# EAGLE design HomeBoard (EAGLE 9.6.2)
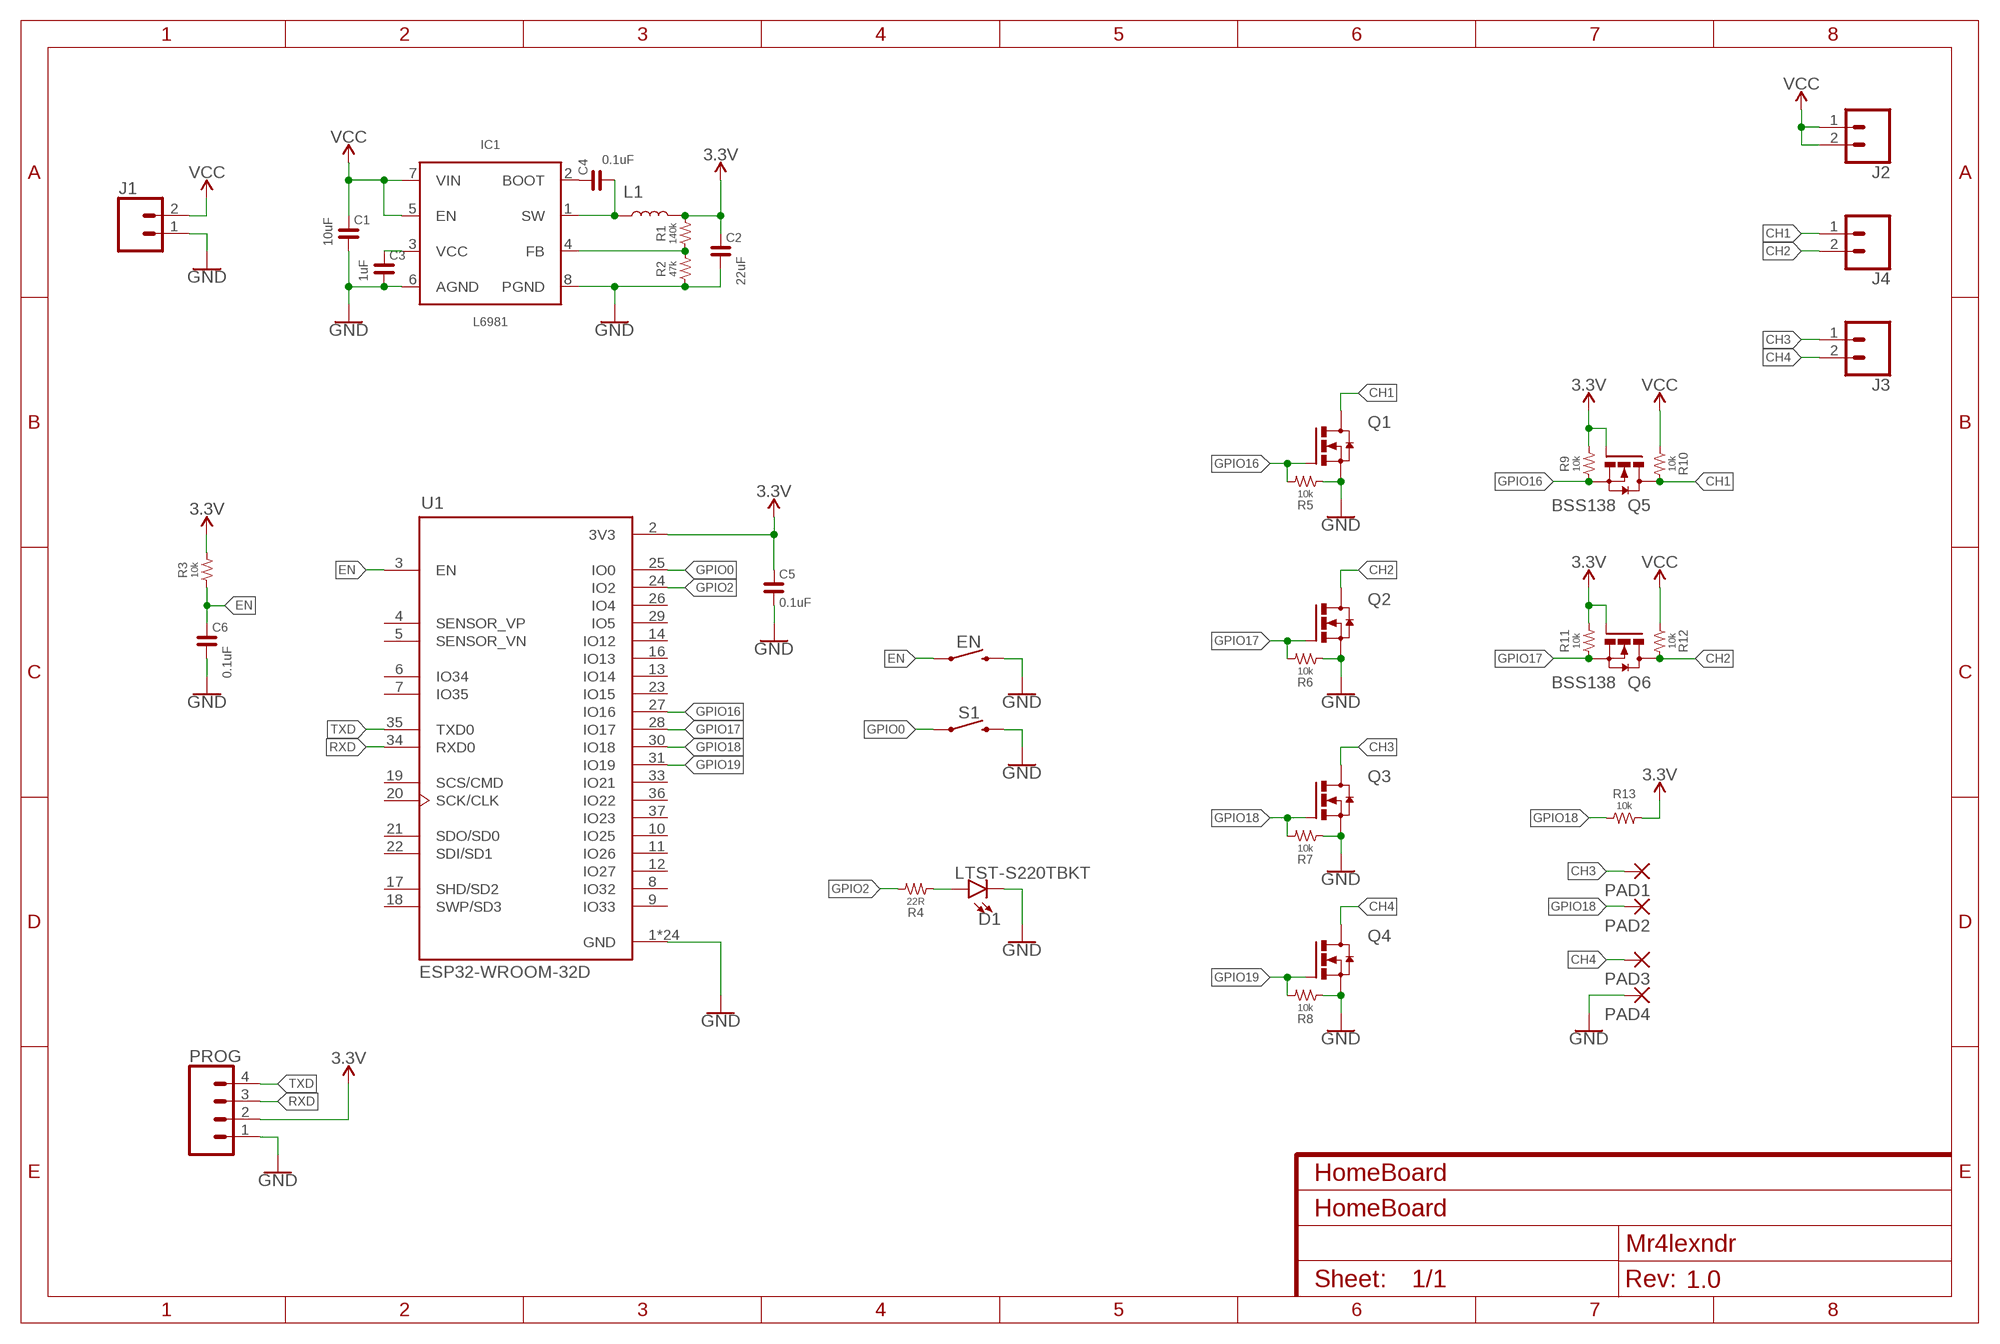
[diagram p0: schematic, sheet 1]
FRAME1 (FRAME-A4L): CNAME: HomeBoard; CREVISION: 1.0; DESIGNER: Mr4lexndr

## Parts
C1  10uF  CAP-1206  [1206]
C2  22uF  CAP-1206  [1206]
C3  1uF  CAP-0603  [0603]
C4  0.1uF  CAP-0603  [0603]
C5  0.1uF  CAP-0603  [0603]
C6  0.1uF  CAP-0603  [0603]
D1  LTST-S220TBKT  LED-ANGLE-2MM  [LED-ANGLE-2MM]
EN  MOMENTARY-SWITCH-SPST-SMD-6.0X3.5MM  [TACTILE_SWITCH_SMD_6.0X3.5MM]
IC1  L6981  [SO-8L]
J1  CONN_025MM  [SCREWTERMINAL-5MM-2]
J2  CONN_025MM  [SCREWTERMINAL-5MM-2]
J3  CONN_025MM  [SCREWTERMINAL-5MM-2]
J4  CONN_025MM  [SCREWTERMINAL-5MM-2]
L1  INDUCTOR-7.3X6.6  [INDUCTOR-7.3X6.6]
PAD1  SMD_PADSMD-1X1.5MM  [SMD1X1.5MM]
PAD2  SMD_PADSMD-1X1.5MM  [SMD1X1.5MM]
PAD3  SMD_PADSMD-1X1.5MM  [SMD1X1.5MM]
PAD4  SMD_PADSMD-1X1.5MM  [SMD1X1.5MM]
PROG  CONN_04LOCK  [1X04_LOCK]
Q1  MOSFET-N-DPAK  [D-PAK_TO252AA]
Q2  MOSFET-N-DPAK  [D-PAK_TO252AA]
Q3  MOSFET-N-DPAK  [D-PAK_TO252AA]
Q4  MOSFET-N-DPAK  [D-PAK_TO252AA]
Q5  BSS138  MOSFET-N-SOT23-3  [SOT23-3]
Q6  BSS138  MOSFET-N-SOT23-3  [SOT23-3]
R1  140k  RESISTOR0603  [0603]
R2  47k  RESISTOR0603  [0603]
R3  10k  RESISTOR0603  [0603]
R4  22R  RESISTOR0603  [0603]
R5  10k  RESISTOR0603  [0603]
R6  10k  RESISTOR0603  [0603]
R7  10k  RESISTOR0603  [0603]
R8  10k  RESISTOR0603  [0603]
R9  10k  RESISTOR0603  [0603]
R10  10k  RESISTOR0603  [0603]
R11  10k  RESISTOR0603  [0603]
R12  10k  RESISTOR0603  [0603]
R13  10k  RESISTOR0603  [0603]
S1  MOMENTARY-SWITCH-SPST-PTH-RIGHT-ANGLE-KIT  [TACTILE_SWITCH_PTH_RIGHT_ANGLE_KIT]
U1  ESP32-WROOM-32D  [MODULE_ESP32-WROOM-32D]

## Nets
3.3V: C2.2 C5.2 L1.P$2 PROG.2 Q5.1(G) Q6.1(G) R1.2 R3.2 R9.2 R11.2 R13.2 U1.2(3V3)
CH1: J4.1 Q1.4(D) Q5.3(D) R10.2
CH2: J4.2 Q2.4(D) Q6.3(D) R12.2
CH3: J3.1 PAD1.P$1(P) Q3.4(D)
CH4: J3.2 PAD3.P$1(P) Q4.4(D)
EN: C6.2 EN.1 R3.1 U1.3(EN)
GND: C1.1 C2.1 C3.1 C5.1 C6.1 D1.C EN.2 IC1.6(AGND) IC1.8(PGND) J1.1 PAD4.P$1(P) PROG.1 Q1.3(S) Q2.3(S) Q3.3(S) Q4.3(S) R2.1 R5.1 R6.1 R7.1 R8.1 S1.2 U1.1(GND) U1.15(GND) U1.38(GND) U1.39_1(GND) U1.39_2(GND) U1.39_3(GND) U1.39_4(GND) U1.39_5(GND) U1.39_6(GND) U1.39_7(GND) U1.39_8(GND) U1.39_9(GND) U1.39_10(GND) U1.39_11(GND) U1.39_12(GND) U1.39_13(GND) U1.39_14(GND) U1.39_15(GND) U1.39_16(GND) U1.39_17(GND) U1.39_18(GND) U1.39_19(GND) U1.39_20(GND) U1.39_21(GND)
GPIO0: S1.1 U1.25(IO0)
GPIO2: R4.2 U1.24(IO2)
GPIO16: Q1.1(G) Q5.2(S) R5.2 R9.1 U1.27(IO16)
GPIO17: Q2.1(G) Q6.2(S) R6.2 R11.1 U1.28(IO17)
GPIO18: PAD2.P$1(P) Q3.1(G) R7.2 R13.1 U1.30(IO18)
GPIO19: Q4.1(G) R8.2 U1.31(IO19)
N$1: IC1.4(FB) R1.1 R2.2
N$2: C4.1 IC1.1(SW) L1.P$1
N$3: C4.2 IC1.2(BOOT)
N$4: D1.A R4.1
N$7: C3.2 IC1.3(VCC)
RXD: PROG.3 U1.34(RXD0)
TXD: PROG.4 U1.35(TXD0)
VCC: C1.2 IC1.5(EN) IC1.7(VIN) J1.2 J2.1 J2.2 R10.1 R12.1
Unconnected: U1.4(SENSOR_VP) U1.5(SENSOR_VN) U1.6(IO34) U1.7(IO35) U1.8(IO32) U1.9(IO33) U1.10(IO25) U1.11(IO26) U1.12(IO27) U1.13(IO14) U1.14(IO12) U1.16(IO13) U1.17(SHD/SD2) U1.18(SWP/SD3) U1.19(SCS/CMD) U1.20(SCK/CLK) U1.21(SDO/SD0) U1.22(SDI/SD1) U1.23(IO15) U1.26(IO4) U1.29(IO5) U1.33(IO21) U1.36(IO22) U1.37(IO23)

## Library data of the parts
C1-C6 = #AK-Library:CAP
D1 = #AK-Library:LED: LED (Generic) Standard schematic elements and footprints for 5mm, 3mm, 1206, and 0603 sized LEDs. Generic LEDs with no color specified.
EN = #AK-Library:MOMENTARY-SWITCH-SPST: Momentary Switch (Pushbutton) - SPST Normally-open (NO) SPST momentary switches (buttons, pushbuttons). Variants PTH-12MM - 12mm square, through-hole Momentary Pushbutton Switch - 12mm Square <https://www.sparkfun.com/products/9190> (COM-09190) PTH-6.0MM, PTH-6.0MM-KIT - 6.0mm square, through-hole Mini Pushbutton Switch <https://www.sparkfun.com/products/97> (COM-00097) KIT package intended for soldering kit's - only one side of pads' copper is exposed. PTH-RIGHT-ANGLE-KIT - Right-angle, through-hole Right Angle Tactile Button <https://www.sparkfun.com/products/10791> - Used on SparkFun BigTime Watch Kit <https://www.sparkfun.com/products/11734> SMD-12MM - 12mm square, surface-mount Tactile Button - SMD (12mm) <https://www.sparkfun.com/products/12993> (COM-12993) Used on SparkFun PicoBoard <https://www.sparkfun.com/products/11888> SMD-4.5MM - 4.5mm Square Trackball Switch Used on SparkFun Blackberry Trackballer Breakout <https://www.sparkfun.com/products/13169> SMD-4.6MMX2.8MM - 4.60mm x 2.80mm, surface mount Used on SparkFun SAMD21 Mini Breakout <https://www.sparkfun.com/products/13664> SMD-5.2MM, SMD-5.2-REDUNDANT - 5.2mm square, surface-mount Mini Pushbutton Switch - SMD <https://www.sparkfun.com/products/8720> (COM-08720) Used on Arduino Pro Mini <https://www.sparkfun.com/products/11114> REDUNDANT package connects both switch circuits together SMD-6.0X3.5MM - 6.0 x 3.5mm, surface mount Momentary Reset Switch SMD <https://www.sparkfun.com/products/8229> (COM-08229) SMD-6.2MM-TALL - 6.2mm square, surface mount Tactile Button - SMD (6mm) <https://www.sparkfun.com/products/12992> Used on SparkFun Digital Sandbox <https://www.sparkfun.com/products/12651> SMD-RIGHT-ANGLE - Right-angle, surface mount Used on SparkFun Block for Intel® Edison - Arduino <https://www.sparkfun.com/products/13036>; PROD_ID: SWCH-00815; SF_SKU: COM-08229
IC1 = #AK-Library:L6981: L6981 38 V, 1.5 A synchronous step-down converter
J1-J4 = #Connectors:CONN_02: Multi connection point. Often used as Generic Header-pin footprint for 0.1 inch spaced/style header connections On any of the 0.1 inch spaced packages, you can populate with these: Break Away Headers - Straight <https://www.sparkfun.com/products/116> (PRT-00116) Break Away Male Headers - Right Angle <https://www.sparkfun.com/products/553> (PRT-00553) Female Headers <https://www.sparkfun.com/products/115> (PRT-00115) Break Away Headers - Machine Pin <https://www.sparkfun.com/products/117> (PRT-00117) Break Away Female Headers - Swiss Machine Pin <https://www.sparkfun.com/products/743> (PRT-00743) For SCREWTERMINALS and SPRING TERMINALS visit here: Screw Terimnals on SparkFun.com <https://www.sparkfun.com/search/results?term=Screw+Terminals> (5mm/3.5mm/2.54mm spacing) This device is also useful as a general connection point to wire up your design to another part of your project. Our various solder wires solder well into these plated through hole pads. Hook-Up Wire - Assortment (Stranded, 22 AWG) <https://www.sparkfun.com/products/11375> (PRT-11375) Hook-Up Wire - Assortment (Solid Core, 22 AWG) <https://www.sparkfun.com/products/11367> (PRT-11367) View the entire wire category on our website here <https://www.sparkfun.com/categories/141> Special notes: Molex polarized connector foot print use with: PRT-08233 with associated crimp pins and housings. 2.54_SCREWTERM for use with PRT-10571. 3.5mm Screw Terminal footprints for PRT-08084 5mm Screw Terminal footprints for use with PRT-08432; SF_SKU: PRT-08432
L1 = #AK-Library:INDUCTOR: Inductor Resist changes in electrical current. Basically a coil of wire.
PAD1-PAD4 = #Connectors:SMD_PAD
PROG = #Connectors:CONN_04: Multi connection point. Often used as Generic Header-pin footprint for 0.1 inch spaced/style header connections On any of the 0.1 inch spaced packages, you can populate with these: Break Away Headers - Straight <https://www.sparkfun.com/products/116> (PRT-00116) Break Away Male Headers - Right Angle <https://www.sparkfun.com/products/553> (PRT-00553) Female Headers <https://www.sparkfun.com/products/115> (PRT-00115) Break Away Headers - Machine Pin <https://www.sparkfun.com/products/117> (PRT-00117) Break Away Female Headers - Swiss Machine Pin <https://www.sparkfun.com/products/743> (PRT-00743) For SCREWTERMINALS and SPRING TERMINALS visit here: Screw Terimnals on SparkFun.com <https://www.sparkfun.com/search/results?term=Screw+Terminals> (5mm/3.5mm/2.54mm spacing) This device is also useful as a general connection point to wire up your design to another part of your project. Our various solder wires solder well into these plated through hole pads. Hook-Up Wire - Assortment (Stranded, 22 AWG) <https://www.sparkfun.com/products/11375> (PRT-11375) Hook-Up Wire - Assortment (Solid Core, 22 AWG) <https://www.sparkfun.com/products/11367> (PRT-11367) View the entire wire category on our website here <https://www.sparkfun.com/categories/141> Special notes: Molex polarized connector foot print use with SKU : PRT-08231 with associated crimp pins and housings. 1MM SMD Version SKU: PRT-10208; PROD_ID: CONN-09696
Q1-Q6 = #AK-Library:MOSFET-N: N-Channel MOSFET in various packages Packages: SOT23-3: BSS138, TO-252 (D-PAK): RFD14N05L
R1-R13 = #AK-Library:RESISTOR: Generic Resistor Package
S1 = #AK-Library:MOMENTARY-SWITCH-SPST: Momentary Switch (Pushbutton) - SPST Normally-open (NO) SPST momentary switches (buttons, pushbuttons). Variants PTH-12MM - 12mm square, through-hole Momentary Pushbutton Switch - 12mm Square <https://www.sparkfun.com/products/9190> (COM-09190) PTH-6.0MM, PTH-6.0MM-KIT - 6.0mm square, through-hole Mini Pushbutton Switch <https://www.sparkfun.com/products/97> (COM-00097) KIT package intended for soldering kit's - only one side of pads' copper is exposed. PTH-RIGHT-ANGLE-KIT - Right-angle, through-hole Right Angle Tactile Button <https://www.sparkfun.com/products/10791> - Used on SparkFun BigTime Watch Kit <https://www.sparkfun.com/products/11734> SMD-12MM - 12mm square, surface-mount Tactile Button - SMD (12mm) <https://www.sparkfun.com/products/12993> (COM-12993) Used on SparkFun PicoBoard <https://www.sparkfun.com/products/11888> SMD-4.5MM - 4.5mm Square Trackball Switch Used on SparkFun Blackberry Trackballer Breakout <https://www.sparkfun.com/products/13169> SMD-4.6MMX2.8MM - 4.60mm x 2.80mm, surface mount Used on SparkFun SAMD21 Mini Breakout <https://www.sparkfun.com/products/13664> SMD-5.2MM, SMD-5.2-REDUNDANT - 5.2mm square, surface-mount Mini Pushbutton Switch - SMD <https://www.sparkfun.com/products/8720> (COM-08720) Used on Arduino Pro Mini <https://www.sparkfun.com/products/11114> REDUNDANT package connects both switch circuits together SMD-6.0X3.5MM - 6.0 x 3.5mm, surface mount Momentary Reset Switch SMD <https://www.sparkfun.com/products/8229> (COM-08229) SMD-6.2MM-TALL - 6.2mm square, surface mount Tactile Button - SMD (6mm) <https://www.sparkfun.com/products/12992> Used on SparkFun Digital Sandbox <https://www.sparkfun.com/products/12651> SMD-RIGHT-ANGLE - Right-angle, surface mount Used on SparkFun Block for Intel® Edison - Arduino <https://www.sparkfun.com/products/13036>; PROD_ID: CONN-10672; SF_SKU: COM-10791
U1 = #AK-Library:ESP32-WROOM-32D: Bluetooth, WiFi 802.11b/g/n, Bluetooth v4.2 + EDR, Class 1, 2 and 3 Transceiver Module 2.4GHz ~ 2.5GHz Integrated, Trace Surface Mount Check prices <https://pricing.snapeda.com/parts/ESP32-WROOM-32D/Espressif%20Systems/view-part?ref=eda>; AVAILABILITY: Not in stock; DESCRIPTION: Bluetooth, WiFi 802.11b/g/n, Bluetooth v4.2 +EDR, Class 1, 2 and 3 Transceiver Module 2.4GHz ~ 2.5GHz Integrated; MF: Espressif Systems; MP: ESP32-WROOM-32D; PACKAGE: Module Espressif Systems; PRICE: None

## Board
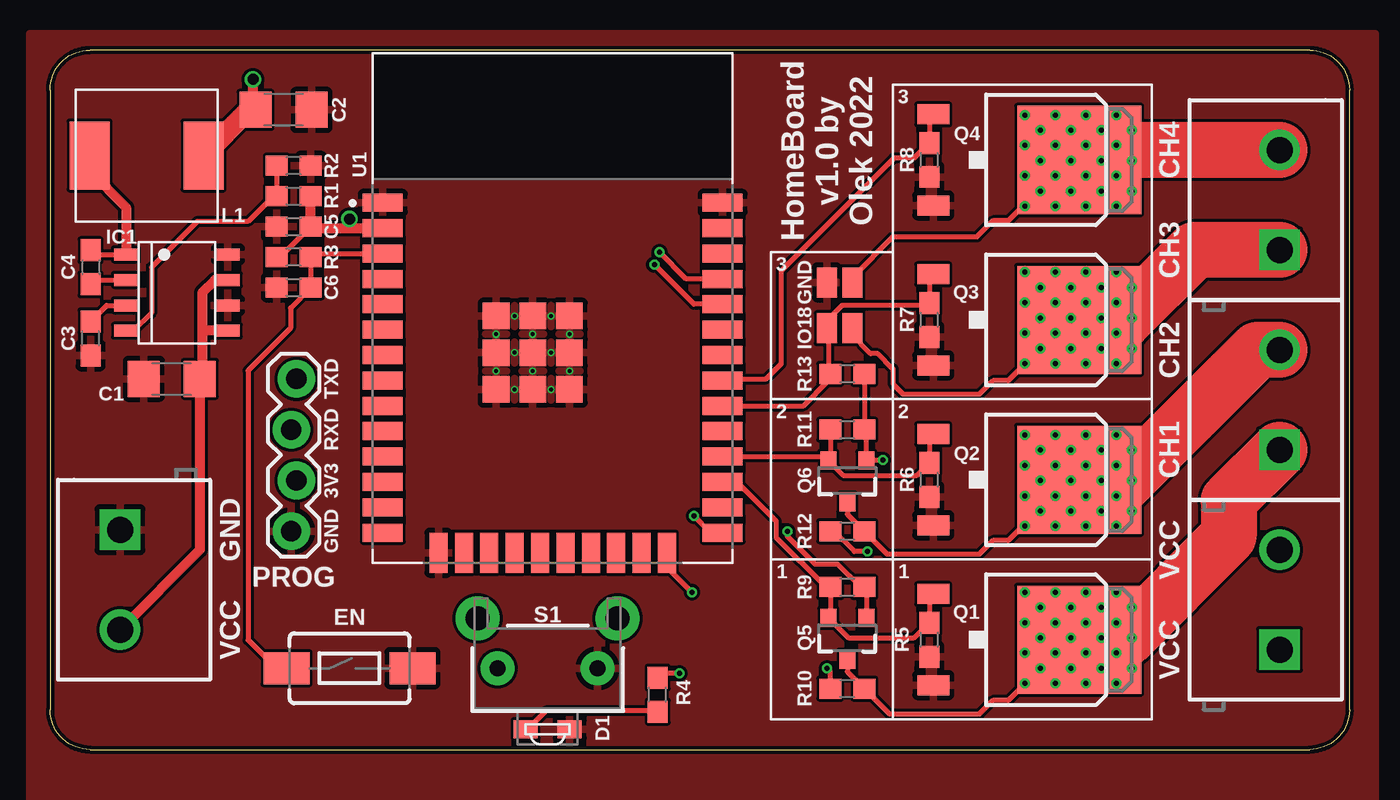
[diagram p1: board, top side]
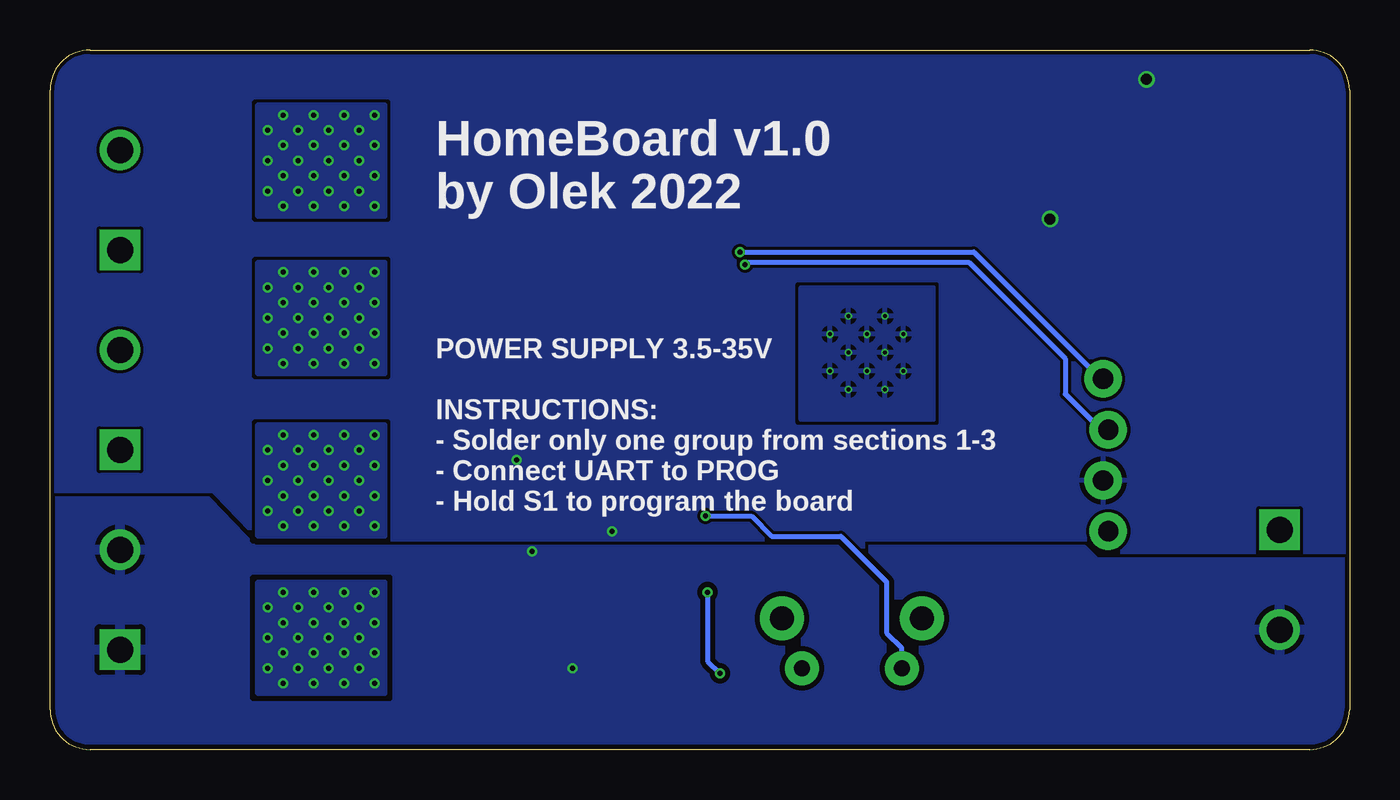
[diagram p2: board, bottom side, seen from below]

Size 65 x 35 mm. Coordinates in mm from the lower left corner, seen from the top.
Outline: 2,0 63,0 arc90 65,2 65,33 arc90 63,35 2,35 arc90 0,33 0,2 arc90 2,0
Copper layers (1*16): Top 0.035mm / dielectric 1.5mm / Bottom 0.035mm
Design rules "JLCPCB": minimum track width 6mil, minimum drill 0.2mm, track to track 6mil, track to pad 6mil, pad to pad 6mil, via to via 6mil, smd to smd 6mil, copper to edge 0.2mm, drill to drill 0.1mm, minimum pad ring 3mil, minimum via ring 0.125mm, stop-mask expansion 4mil, vias tented up to drill 0.75mm, thermal gap 10mil

### Footprints (pad centres in the part's own frame; a part is rotated, then mirrored left to right if it is on the bottom)
1206 = smd 1.6 x 1.8: 1 -1.4,0; 2 1.4,0
0603 = smd 1.1 x 1: 1 -0.85,0; 2 0.85,0
LED-ANGLE-2MM = smd 0.9 x 1.2: A 0,1.1; C 0,-1.1
TACTILE_SWITCH_SMD_6.0X3.5MM = smd 2.3 x 1.6: 1 -3.15,0; 2 3.15,0
SO-8L = smd 0.6 x 1.2: 1 -1.905,-2.54; 2 -0.635,-2.54; 3 0.635,-2.54; 4 1.905,-2.54; 5 1.905,2.54; 6 0.635,2.54; 7 -0.635,2.54; 8 -1.905,2.54
SCREWTERMINAL-5MM-2 = drill 1.3 pad 2.032 square: 1 0,0 | drill 1.3 pad 2.032: 2 5,0
INDUCTOR-7.3X6.6 = smd 2 x 3.4: P$1 -2.85,0; P$2 2.85,0
SMD1X1.5MM = smd 1.5 x 1: P$1 0,0
1X04_LOCK = drill 1.016 pad 1.88: 1 0,0.127; 2 2.54,-0.127; 3 5.08,0.127; 4 7.62,-0.127
D-PAK_TO252AA = smd 1 x 1.6: 1 -2.28,-4.8; 3 2.28,-4.8 | smd 5.4 x 6.2: 4 0,2.5
SOT23-3 = smd 0.8 x 0.9: 1 -0.95,-1; 2 0.95,-1; 3 0,1.1
TACTILE_SWITCH_PTH_RIGHT_ANGLE_KIT = drill 0.8 pad 1.7: 1 -2.5,0; 2 2.5,0 | drill 1.2 pad 2.2: ANCHOR1 -3.5,2.5; ANCHOR2 3.5,2.5
MODULE_ESP32-WROOM-32D = smd 2 x 0.9: 1 -8.5,5.26; 2 -8.5,3.99; 3 -8.5,2.72; 4 -8.5,1.45; 5 -8.5,0.18; 6 -8.5,-1.09; 7 -8.5,-2.36; 8 -8.5,-3.63; 9 -8.5,-4.9; 10 -8.5,-6.17; 11 -8.5,-7.44; 12 -8.5,-8.71; 13 -8.5,-9.98; 14 -8.5,-11.25; 25 8.5,-11.25; 26 8.5,-9.98; 27 8.5,-8.71; 28 8.5,-7.44; 29 8.5,-6.17; 30 8.5,-4.9; 31 8.5,-3.63; 32 8.5,-2.36; 33 8.5,-1.09; 34 8.5,0.18; 35 8.5,1.45; 36 8.5,2.72; 37 8.5,3.99; 38 8.5,5.26 | smd 0.9 x 2: 15 -5.715,-12.25; 16 -4.445,-12.25; 17 -3.175,-12.25; 18 -1.905,-12.25; 19 -0.635,-12.25; 20 0.635,-12.25; 21 1.905,-12.25; 22 3.175,-12.25; 23 4.445,-12.25; 24 5.715,-12.25 | smd 1.33 x 1.33: 39_1 -2.835,-0.405; 39_2 -1,-0.405; 39_3 0.835,-0.405; 39_4 -2.835,-2.24; 39_5 -1,-2.24; 39_6 0.835,-2.24; 39_7 -2.835,-4.075; 39_8 -1,-4.075; 39_9 0.835,-4.075 | drill 0.2 pad 0.3: 39_10 -1.917,-0.405; 39_11 -0.083,-0.405; 39_12 -2.835,-1.323; 39_13 -1,-1.323; 39_14 0.835,-1.323; 39_15 -1.917,-2.24; 39_16 -0.083,-2.24; 39_17 -2.835,-3.158; 39_18 -1,-3.158; 39_19 0.835,-3.158; 39_20 -1.917,-4.075; 39_21 -0.083,-4.075

### Placement (x,y rotation side)
C1  6.1,18.54 0 top
C2  11.68,32 180 top
C3  2.03,20.57 90 top
C4  2.03,24.13 270 top
C5  12.19,26.16 0 top
C6  12.19,23.11 0 top
D1  24.89,1.02 90 top
EN  14.99,4.06 0 top
IC1  6.35,22.86 270 top
J1  3.5,11 270 top
J2  61.5,5 90 top
J3  61.5,25 90 top
J4  61.5,15 90 top
L1  4.83,29.72 0 top
PAD1  40.13,21.08 270 top
PAD2  38.86,21.08 270 top
PAD3  40.13,23.37 270 top
PAD4  38.86,23.37 270 top
PROG  12.19,10.92 90 top
Q1  48.98,5.5 270 top
Q2  48.98,13.5 270 top
Q3  48.98,21.5 270 top
Q4  48.98,29.5 270 top
Q5  39.88,5.59 180 top
Q6  39.88,13.46 180 top
R1  12.19,27.69 0 top
R2  12.19,29.21 180 top
R3  12.19,24.64 180 top
R4  30.39,2.75 90 top
R5  43.98,5.5 90 top
R6  43.98,13.5 90 top
R7  43.98,21.5 90 top
R8  43.98,29.5 90 top
R9  39.88,8.13 0 top
R10  39.88,3.05 0 top
R11  39.88,16 0 top
R12  39.88,10.92 0 top
R13  39.88,18.8 0 top
S1  24.89,4.06 0 top
U1  25.15,22.1 0 top

### Tracks (layer width: path | path; a pad name or v marks a point on that pad's centre or on a via)
3.3V  (via drill 0.25, 0.55)
  Top 0.254: C5.2 11.52,24.64 R3.2 | 40.83,15.9 Q6.1 40.84,14.48 v41.66,14.48 | 40.83,15.9 R11.2 | R9.2 40.83,8.03 Q5.1 40.84,6.6 | R9.2 40.73,8.22 | v36.88,10.92 36.88,10.67 38.28,9.27 39.4,9.27 40.54,8.13 R9.2 | R13.2 R11.2 | R11.2 40.83,15.9
  Top 0.508: R1.2 C5.2 13.12,26.09 14.73,26.09 14.99,26.09 | 10.28,31.88 C2.2 10.16,32.13 v10.16,33.53 | 14.99,26.09 U1.2 | 14.99,26.09 v14.99,26.54
  Top 1.016: L1.P$2 9.96,32 C2.2
  pour Bottom (rank 3): -0.25,35.31 -0.25,-1.52 65.53,-1.52 65.53,35.56 -0.25,35.56
CH1  (via drill 0.25)
  Top 0.254: Q5.3 39.88,3.9 R10.2 42,1.78 46.49,1.78 47.17,2.45 47.93,2.45 50.98,5.5 51.31,5.5 Q1.4
  Top 2.794: 53.09,5.08 v51.82,6.35 | 51.31,5.5 Q1.4 | 51.31,5.5 51.14,5.5 v51.05,5.59 | J4.1 58.96,12.46 58.96,10.68 53.78,5.5 51.31,5.5
  other vias: 48.77,7.87 49.53,7.11 50.29,7.87 50.29,6.35 48.77,6.35 49.53,5.59 48.77,4.83 49.53,4.06 48.77,3.3 50.29,3.3 50.29,4.83 51.05,4.06 51.82,3.3 51.82,4.83 51.05,7.11 51.82,7.87 52.58,7.11 52.58,5.59 52.58,4.06 53.34,3.3 54.1,4.06 53.34,4.83 53.34,6.35 53.34,7.87 54.1,7.11 54.1,5.59
  pour Bottom: 48.26,8.38 48.26,2.79 54.61,2.79 54.61,8.38
CH2  (via drill 0.25)
  Top 0.254: Q6.3 39.88,11.77 R12.2 41.87,9.78 46.49,9.78 47.17,10.45 47.93,10.45 50.49,13.01 50.98,13.5 51.05,13.5
  Top 2.794: Q2.4 52.44,13.5 | Q2.4 51.05,13.5 | Q2.4 51.45,13.46 v51.05,13.46 | J4.2 60.39,20 52.81,12.43 51.07,12.43 50.49,13.01
  other vias: 48.77,15.75 49.53,13.46 50.29,15.75 49.53,14.99 48.77,14.22 50.29,14.22 48.77,12.7 48.77,11.18 49.53,11.94 50.29,11.18 50.29,12.7 51.05,14.99 51.82,15.75 51.82,12.7 51.05,11.94 51.82,11.18 52.58,11.94 52.58,13.46 52.58,14.99 53.34,15.75 53.34,14.22 53.34,12.7 53.34,11.18 54.1,11.94 54.1,13.46 54.1,14.99 51.82,14.22
  pour Bottom: 48.26,16.26 48.26,10.67 54.61,10.67 54.61,16.26
CH3  (via drill 0.25)
  Top 0.254: PAD1.P$1 40.13,20.73 41.05,19.81 41.4,19.81 42.16,19.05 42.16,18.29 42.67,17.78 46.49,17.78 47.17,18.45 47.93,18.45 50.98,21.5 Q3.4
  Top 2.794: Q3.4 51.82,21.17 v51.82,20.83 | J3.1 57.26,25 53.59,21.34 52.83,21.34 v51.82,22.35
  Top 3.048: Q3.4 53,21.5
  other vias: 48.77,23.88 49.53,23.11 50.29,22.35 51.05,21.59 52.58,20.07 53.34,19.3 48.77,22.35 48.77,20.83 49.53,21.59 50.29,23.88 51.05,23.11 51.82,23.88 52.58,23.11 52.58,21.59 53.34,20.83 53.34,22.35 53.34,23.88 49.53,20.07 54.1,23.11 54.1,21.59 54.1,20.07 51.82,19.3 50.29,19.3 50.29,20.83 51.05,20.07 48.77,19.3
  pour Bottom: 48.26,24.38 48.26,18.8 54.61,18.8 54.61,24.38
CH4  (via drill 0.25)
  Top 0.254: 51.05,29.5 50.98,29.5 47.93,26.45 47.17,26.45 46.37,25.65 42.16,25.65 40.13,23.62 PAD3.P$1
  Top 2.794: Q4.4 51.05,29.5 | Q4.4 51.48,29.03 v51.82,28.7 | 51.98,30 Q4.4 | J3.2 51.95,30 51.75,30.2
  Top 3.048: 51.75,30.2 51.05,29.5
  other vias: 48.77,31.75 49.53,30.99 50.29,31.75 50.29,30.23 48.77,30.23 49.53,29.46 48.77,28.7 48.77,27.18 49.53,27.94 50.29,28.7 50.29,27.18 51.05,27.94 51.05,29.46 51.05,30.99 51.82,31.75 51.82,30.23 51.82,27.18 52.58,27.94 52.58,29.46 52.58,30.99 53.34,31.75 53.34,30.23 53.34,28.7 53.34,27.18 54.1,27.94 54.1,29.46 54.1,30.99
  pour Bottom (rank 2): 48.26,32.26 48.26,26.67 54.61,26.67 54.61,32.26
EN
  Top 0.254: U1.3 13.22,24.82 R3.1 C6.2 12.03,22.1 12.03,21.08 9.91,18.96 9.91,5.49 11.33,4.06 EN.1
GND
  pour Bottom (rank 2): 20.83,23.11 20.83,16.51 27.43,16.51 27.43,23.11
  pour Top: -1.02,35.81 66.29,35.81 66.29,-2.54 -1.02,-2.54
GPIO0  (via drill 0.25)
  Top 0.254: U1.25 33.04,10.85 32.61,11.28 v32.21,11.68
  Bottom 0.254: S1.1 22.39,5.08 23.15,5.84 23.15,8.38 25.44,10.67 28.91,10.67 29.92,11.68 v32.21,11.68
GPIO2  (via drill 0.25)
  Top 0.254: 30.9,9.81 U1.24 30.86,9.12 v32.11,7.87 | R4.2 30.61,3.81 v31.5,3.81
  Bottom 0.254: v32.11,7.87 32.11,4.42 v31.5,3.81
GPIO16
  Top 0.254: Q1.1 44.11,7.71 43.98,7.58 R5.2 43.22,5.59 39.93,5.59 Q5.2 39.03,6.69 R9.1 | U1.27 34.04,13.39 | 34.04,13.39 34.36,13.39 | 39.03,8.22 R9.1 | 34.36,13.39 36.32,11.43 36.32,10.62 38.81,8.13 R9.1 | 34.36,13.39 34.04,13.39
GPIO17
  Top 0.254: Q2.1 43.98,15.58 R6.2 43.35,13.72 39.67,13.72 Q6.2 38.89,14.5 | U1.28 38.73,14.66 38.89,14.5 | R11.1 39.03,14.64 38.89,14.5
GPIO18
  Top 0.254: Q3.1 43.98,23.58 R7.2 43.86,22.23 39.62,22.23 38.86,21.46 PAD2.P$1 38.95,21 38.95,18.71 | 38.95,18.71 R13.1 | U1.30 37.68,17.2 38.95,18.46 38.95,18.71
GPIO19
  Top 0.254: Q4.1 43.98,31.58 R8.2 43.22,29.59 42.21,29.59 36.58,23.96 36.58,19.3 35.81,18.54 33.72,18.54 U1.31
N$1
  Top 0.254: R2.2 R1.1 11.18,27.69 9.91,26.42 7.37,26.42 5.08,24.13 5.08,21.84 4.19,20.95 IC1.4
N$2
  Top 0.254: C4.1 2.25,24.77 IC1.1
  Top 0.508: L1.P$1 1.98,28.96 3.81,27.12 IC1.1
N$3
  Top 0.254: C4.2 2.25,23.5 IC1.2
N$4
  Top 0.254: R4.1 30.36,1.93 24.81,1.93 23.9,1.02 D1.A
N$7
  Top 0.254: C3.2 2.83,22.23 IC1.3
RXD  (via drill 0.25)
  Top 0.254: U1.34 32.2,22.28 v30.23,24.26
  Bottom 0.254: v30.23,24.26 30.1,24.38 19.05,24.38 14.22,19.56 14.22,17.78 12.45,16 PROG.3
TXD  (via drill 0.25)
  Top 0.254: U1.35 31.82,23.55 v30.48,24.89
  Bottom 0.254: v30.48,24.89 18.8,24.89 12.45,18.54 PROG.4
VCC  (via drill 0.25)
  Top 0.254: R12.1 39.22,10.92 40.23,9.91 v40.89,9.91 | R10.1 39.03,3.9 v38.86,4.06
  Top 0.508: IC1.7 8.26,23.5 7.62,22.86 7.62,21.08 | 7.62,21.08 7.62,20.95 | 7.62,21.34 7.62,21.08 | 7.62,21.08 7.62,18.67 C1.2 7.5,10 J1.2 | IC1.5 7.75,20.95 7.62,21.08
  pour Bottom (isolate 0.254, rank 2): -1.02,9.4 -1,-0.25 67.31,-0.25 67.31,12.45 57.15,12.45 54.81,10.01 13.31,10.01 12.7,9.4

### Text on the board
tNames: 3 | HomeBoard / v1.0 by / Olek 2022 | CH4 | 3 | CH3 | GND | IO18 | CH2 | TXD | 2 | 2 | RXD | CH1 | 3V3 | GND | GND | VCC | 1 | 1 | VCC | VCC
bNames: HomeBoard v1.0 / by Olek 2022 | POWER SUPPLY 3.5-35V / / INSTRUCTIONS: / - Solder only one group from sections 1-3 / - Connect UART to PROG / - Hold S1 to program the board